# Altium project SIM7600_M_V2.1.PrjPCB
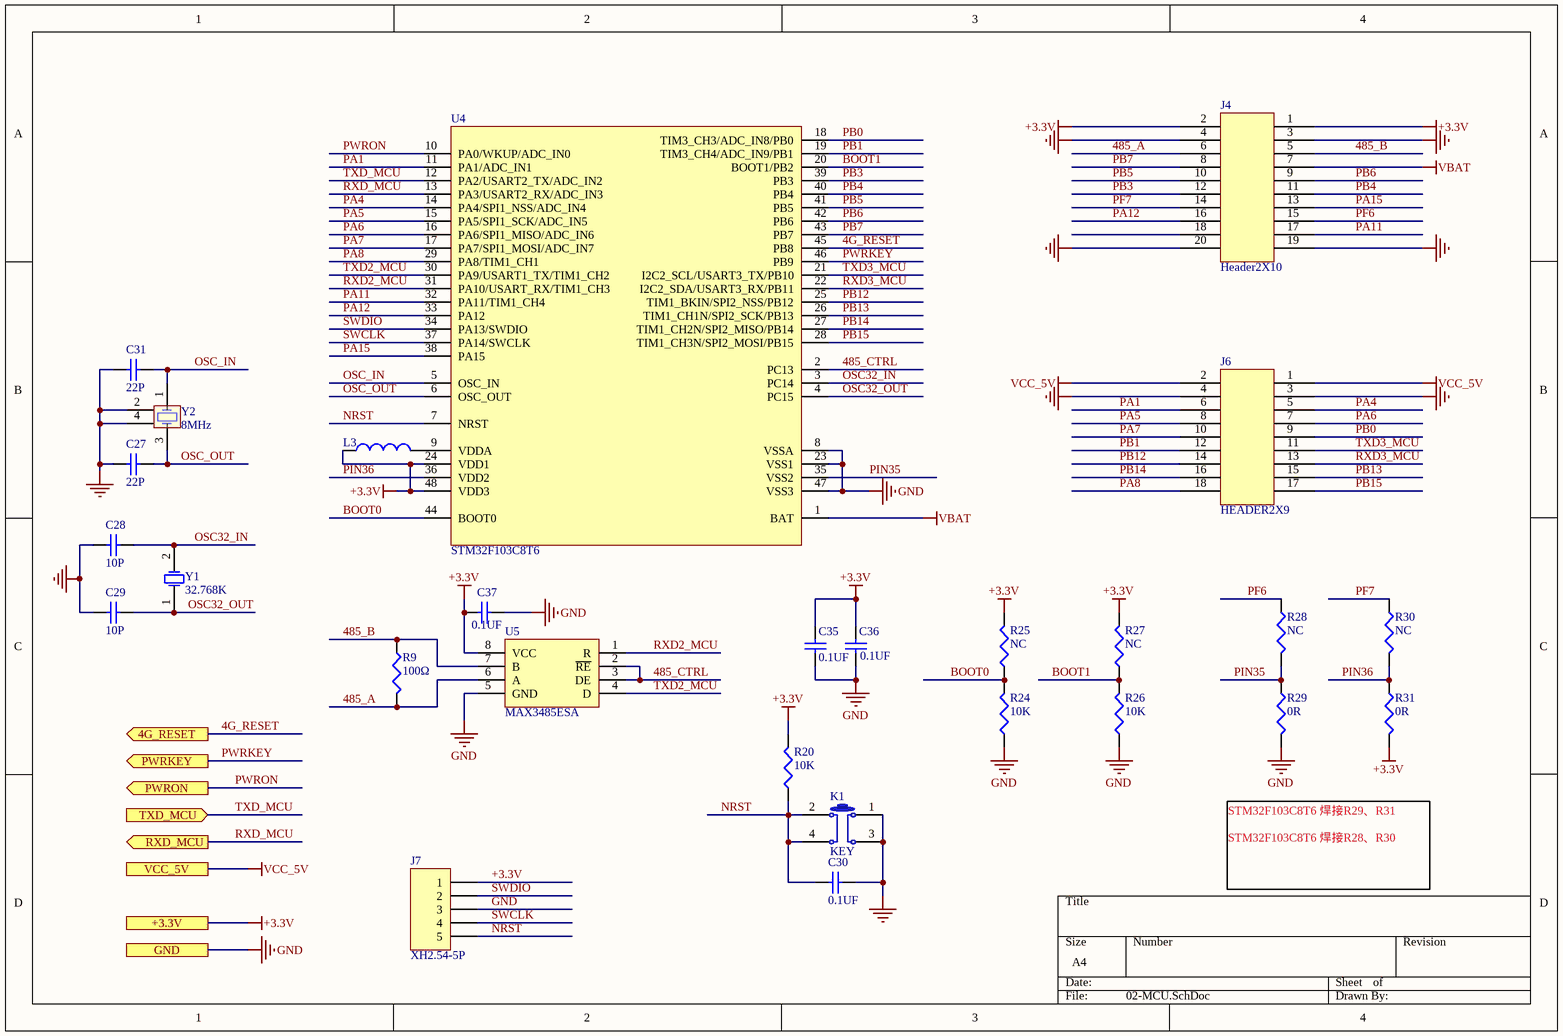
[diagram p0: 02-MCU.SchDoc]
2 sheets, 84 parts. Net scope: flat (ports and power ports of the same name join across sheets).
Board file: SIM7600_M_V2.1.1.PcbDoc
Sheets:
  02-MCU.SchDoc
  03-4G.SchDoc

## Sheet 02-MCU.SchDoc
size A4

### Parts
C27  value 22P  [0603_C]  (hidden comment: Cap)
C28  value 10P  [0603_C]  (hidden comment: Cap)
C29  value 10P  [0603_C]  (hidden comment: Cap)
C30  value 0.1UF  [0603_C]  (hidden comment: Cap)
C31  value 22P  [0603_C]  (hidden comment: Cap)
C35  value 0.1UF  [0603_C]  (hidden comment: Cap)
C36  value 0.1UF  [0603_C]  (hidden comment: Cap)
C37  value 0.1UF  [0603_C]  (hidden comment: Cap)
J4  Header2X10  [DIP20-2.54-2.54]
J6  HEADER2X9  [DIP18-2.54-2.54]
J7  XH2.54-5P  [SIP5]
K1  KEY  [KEY_SMD5465]
L3  Inductor  [0603_R]  (value not drawn)
R9  100Ω  [0603_R]
R20  value 10K  [0603_R]  (hidden comment: Res3)
R24  value 10K  [0603_R]  (hidden comment: Res3)
R25  value NC  [0603_R]  (hidden comment: Res3)
R26  value 10K  [0603_R]  (hidden comment: Res3)
R27  value NC  [0603_R]  (hidden comment: Res3)
R28  value NC  [0603_R]  (hidden comment: Res3)
R29  value 0R  [0603_R]  (hidden comment: Res3)
R30  value NC  [0603_R]  (hidden comment: Res3)
R31  value 0R  [0603_R]  (hidden comment: Res3)
U4  STM32F103C8T6  [LQFP48]
U5  MAX3485ESA  [SO8]
Y1  32.768K  [3215]
Y2  8MHz  [CRY_S3225]

### Ports
4G_RESET, +3.3V, GND, PWRKEY, PWRON, RXD_MCU, TXD_MCU, VCC_5V

### Nets
+3.3V: C35.1 C36.1 C37.1 J4.1 J4.2 J7.1 L3.1 R20.2 R25.2 R27.2 R31.2 U4.24(VDD1) U4.48(VDD3) U5.8(VCC) ; port +3.3V
GND: C27.2 C28.2 C29.2 C30.1 C31.2 C35.2 C36.2 C37.2 J4.3 J4.4 J4.19 J4.20 J6.3 J6.4 J7.3 K1.1 K1.3 R24.1 R26.1 R29.2 U4.8(VSSA) U4.23(VSS1) U4.47(VSS3) U5.5(GND) Y2.2 Y2.4 ; port GND
VBAT: J4.7 U4.1(BAT)
VCC_5V: J6.1 J6.2 ; port VCC_5V
4G_RESET: U4.45(PB8) ; port 4G_RESET
485_A: J4.6 R9.2 U5.6(A)
485_B: J4.5 R9.1 U5.7(B)
485_CTRL: U4.2(PC13) U5.2(~{RE}) U5.3(DE)
BOOT0: R24.2 R25.1 U4.44(BOOT0)
BOOT1: R26.2 R27.1 U4.20(BOOT1/PB2)
NRST: C30.2 J7.5 K1.2 K1.4 R20.1 U4.7(NRST)
OSC32_IN: C28.1 U4.3(PC14) Y1.2(OSC2)
OSC32_OUT: C29.1 U4.4(PC15) Y1.1(OSC1)
OSC_IN: C31.1 U4.5(OSC_IN) Y2.1
OSC_OUT: C27.1 U4.6(OSC_OUT) Y2.3
PA1: J6.6 U4.11(PA1/ADC_IN1)
PA4: J6.5 U4.14(PA4/SPI1_NSS/ADC_IN4)
PA5: J6.8 U4.15(PA5/SPI1_SCK/ADC_IN5)
PA6: J6.7 U4.16(PA6/SPI1_MISO/ADC_IN6)
PA7: J6.10 U4.17(PA7/SPI1_MOSI/ADC_IN7)
PA8: J6.18 U4.29(PA8/TIM1_CH1)
PA11: J4.17 U4.32(PA11/TIM1_CH4)
PA12: J4.16 U4.33(PA12)
PA15: J4.13 U4.38(PA15)
PB0: J6.9 U4.18(TIM3_CH3/ADC_IN8/PB0)
PB1: J6.12 U4.19(TIM3_CH4/ADC_IN9/PB1)
PB3: J4.12 U4.39(PB3)
PB4: J4.11 U4.40(PB4)
PB5: J4.10 U4.41(PB5)
PB6: J4.9 U4.42(PB6)
PB7: J4.8 U4.43(PB7)
PB12: J6.14 U4.25(TIM1_BKIN/SPI2_NSS/PB12)
PB13: J6.15 U4.26(TIM1_CH1N/SPI2_SCK/PB13)
PB14: J6.16 U4.27(TIM1_CH2N/SPI2_MISO/PB14)
PB15: J6.17 U4.28(TIM1_CH3N/SPI2_MOSI/PB15)
PF6: J4.15 R28.1
PF7: J4.14 R30.1
PIN35: R28.2 R29.1 U4.35(VSS2)
PIN36: R30.2 R31.1 U4.36(VDD2)
PWRKEY: U4.46(PB9) ; port PWRKEY
PWRON: U4.10(PA0/WKUP/ADC_IN0) ; port PWRON
RXD2_MCU: U4.31(PA10/USART_RX/TIM1_CH3) U5.1(R)
RXD3_MCU: J6.13 U4.22(I2C2_SDA/USART3_RX/PB11)
RXD_MCU: U4.13(PA3/USART2_RX/ADC_IN3) ; port RXD_MCU
SWCLK: J7.4 U4.37(PA14/SWCLK)
SWDIO: J7.2 U4.34(PA13/SWDIO)
TXD2_MCU: U4.30(PA9/USART1_TX/TIM1_CH2) U5.4(D)
TXD3_MCU: J6.11 U4.21(I2C2_SCL/USART3_TX/PB10)
TXD_MCU: U4.12(PA2/USART2_TX/ADC_IN2) ; port TXD_MCU
NetL3_2: L3.2 U4.9(VDDA)

Not connected (* = marked no-connect by the designer): J4 18

### Notes on the sheet
- STM32F103C8T6 焊接R29、R31
  STM32F103C8T6 焊接R28、R30

### Library data of the parts
C27-C31 C35-C37 = Cap: Capacitor; Published: 8-Jun-2000; LatestRevisionDate: 17-Jul-2002; LatestRevisionNote: Re-released for DXP Platform.; PackageReference: RAD-0.3; Publisher: Altium Limited
J7 = Header 5H: Header, 5-Pin, Right Angle; LatestRevisionDate: 17-Jul-2002; LatestRevisionNote: Re-released for DXP Platform.; Publisher: Altium Limited
L3 = Inductor: Code_IEC: 1005; Value: GZ1608D601TF; Published: 8-Jun-2000; LatestRevisionDate: 17-Jul-2002; LatestRevisionNote: Re-released for DXP Platform.; PackageReference: 0402-A; Publisher: Altium Limited; Code_JEITA: 0402
R9 = RES1
R20 R24-R31 = Res3: Resistor; Published: 8-Jun-2000; LatestRevisionDate: 04-Mar-2005; LatestRevisionNote: PCB Footprint replaced.; PackageReference: J1-0603; Publisher: Altium Limited
U5 = MAX485
Y1 = XTAL: Crystal Oscillator; Published: 8-Jun-2000; LatestRevisionDate: 17-Jul-2002; LatestRevisionNote: Re-released for DXP Platform.; PackageReference: R38; Publisher: Altium Limited
Y2 = CRYSTAL_S4_1: CRYSTAL_S4_PASSIVE

## Sheet 03-4G.SchDoc
size A3
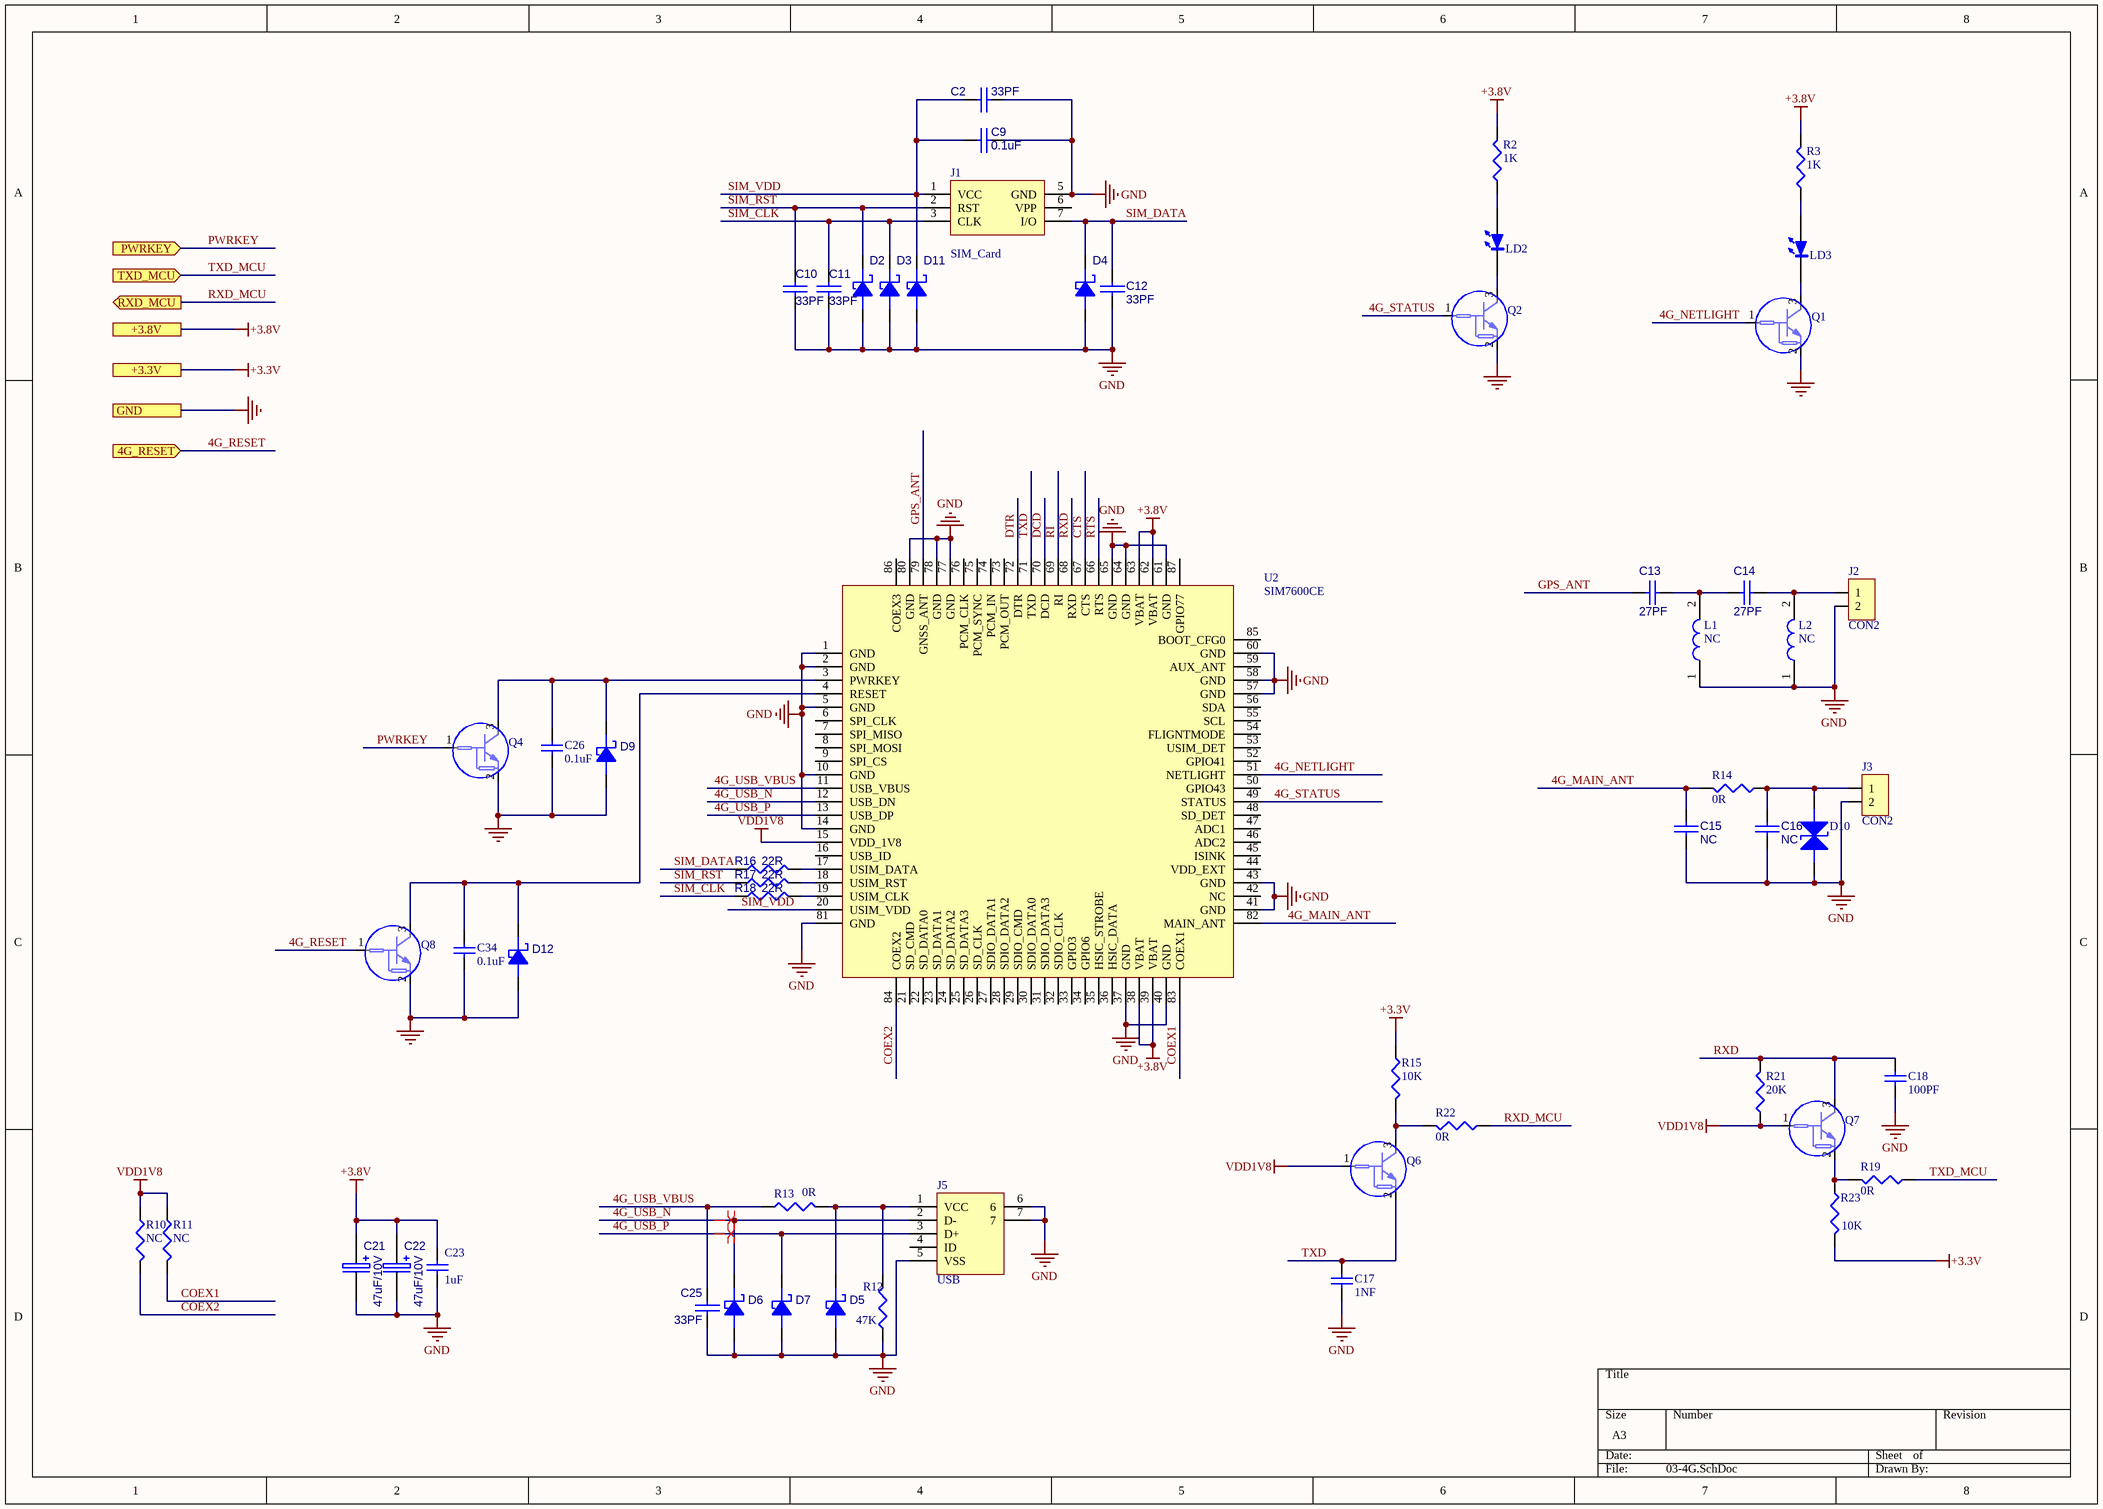
[diagram p1: 03-4G.SchDoc]

### Parts
C2  33PF  [0603_C]
C9  0.1uF  [0603_C]
C10  33PF  [0603_C]
C11  33PF  [0603_C]
C12  33PF  [0603_C]
C13  27PF  [0402]
C14  27PF  [0402]
C15  NC  [0402]
C16  NC  [0402]
C17  1NF  [0603_C]
C18  100PF  [0603_C]
C21  47uF/10V  [C_TAN_B]
C22  47uF/10V  [C_TAN_B]
C23  1uF  [0603_C]
C25  33PF  [0603_C]
C26  0.1uF  [0603_C]
C34  0.1uF  [0603_C]
D2  ESD9M5.0ST5G  [SOD-923]  (value not drawn)
D3  ESD9M5.0ST5G  [SOD-923]  (value not drawn)
D4  ESD9M5.0ST5G  [SOD-923]  (value not drawn)
D5  PESD12VS1UB  [SOD523]  (value not drawn)
D6  ESD9L5.0ST5G  [SOD-923]  (value not drawn)
D7  ESD9L5.0ST5G  [SOD-923]  (value not drawn)
D9  ESD9M5.0ST5G  [SOD-923]  (value not drawn)
D10  LXES15AAA1-153  [0402]  (value not drawn)
D11  ESD9M5.0ST5G  [SOD-923]  (value not drawn)
D12  ESD9M5.0ST5G  [SOD-923]  (value not drawn)
J1  SIM_Card  [MicroSIM-6]
J2  CON2  [RF-Z]
J3  CON2  [RF-Z]
J5  USB
L1  NC  [0402]
L2  NC  [0402]
LD2  WHITE  [LED_0603]  (value not drawn)
LD3  WHITE  [LED_0603]  (value not drawn)
Q1  DTC143ZEBTL  [SC-85]  (value not drawn)
Q2  DTC143ZEBTL  [SC-85]  (value not drawn)
Q4  DTC143ZEBTL  [SC-85]  (value not drawn)
Q6  DTC143ZEBTL  [SC-85]  (value not drawn)
Q7  DTC143ZEBTL  [SC-85]  (value not drawn)
Q8  DTC143ZEBTL  [SC-85]  (value not drawn)
R2  1K  [0603_R]
R3  1K  [0603_R]
R10  NC  [0603_R]
R11  NC  [0603_R]
R12  47K  [0603_R]
R13  0R  [0603_R]
R14  0R  [0402]
R15  10K  [0603_R]
R16  22R  [0603_R]
R17  22R  [0603_R]
R18  22R  [0603_R]
R19  0R  [0603_R]
R21  20K  [0603_R]
R22  0R  [0603_R]
R23  10K  [0603_R]
U2  SIM7600CE  [SIM7600]

### Ports
4G_RESET, +3.3V, +3.8V, GND, PWRKEY, RXD_MCU, TXD_MCU

### Nets
+3.3V: R15.1 R23.2 ; port +3.3V
+3.8V: C21.1(+) C22.1(+) C23.2 R2.1 R3.1 U2.38(VBAT) U2.39(VBAT) U2.62(VBAT) U2.63(VBAT) ; port +3.8V
GND: C2.2 C9.2 C10.1 C11.1 C12.1 C15.1 C16.1 C17.2 C18.1 C21.2(-) C22.2(-) C23.1 C25.2 C26.1 C34.1 D2.1(ANODE) D3.1(ANODE) D4.1(ANODE) D5.1(ANODE) D6.1(ANODE) D7.1(ANODE) D9.1(ANODE) D10.2 D11.1(ANODE) D12.1(ANODE) J1.5(GND) J2.2 J3.2 J5.5(VSS) J5.6 J5.7 L1.1 L2.1 Q1.2(E) Q2.2(E) Q4.2(E) Q8.2(E) R12.2 U2.1(GND) U2.2(GND) U2.5(GND) U2.10(GND) U2.14(GND) U2.37(GND) U2.40(GND) U2.41(GND) U2.43(GND) U2.57(GND) U2.58(GND) U2.60(GND) U2.61(GND) U2.64(GND) U2.65(GND) U2.77(GND) U2.78(GND) U2.80(GND) U2.81(GND) ; port GND
VDD1V8: Q6.1(B) Q7.1(B) R10.1 R11.1 R21.1 U2.15(VDD_1V8)
4G_MAIN_ANT: C15.2 R14.2 U2.82(MAIN_ANT)
4G_NETLIGHT: Q1.1(B) U2.51(NETLIGHT)
4G_RESET: Q8.1(B) ; port 4G_RESET
4G_STATUS: Q2.1(B) U2.49(STATUS)
4G_USB_N: D6.2(CATHODE) J5.2(D-) U2.12(USB_DN)
4G_USB_P: D7.2(CATHODE) J5.3(D+) U2.13(USB_DP)
4G_USB_VBUS: C25.1 R13.1 U2.11(USB_VBUS)
COEX1: R11.2 U2.83(COEX1)
COEX2: R10.2 U2.84(COEX2)
CTS: U2.67(CTS)
DCD: U2.70(DCD)
DTR: U2.72(DTR)
GPS_ANT: C13.1 U2.79(GNSS_ANT)
PWRKEY: Q4.1(B) ; port PWRKEY
RI: U2.69(RI)
RTS: U2.66(RTS)
RXD: C18.2 Q7.3(C) R21.2 U2.68(RXD)
RXD_MCU: R22.1 ; port RXD_MCU
SIM_CLK: C11.2 D3.2(CATHODE) J1.3(CLK) R18.1
SIM_DATA: C12.2 D4.2(CATHODE) J1.7(I/O) R16.1
SIM_RST: C10.2 D2.2(CATHODE) J1.2(RST) R17.1
SIM_VDD: C2.1 C9.1 D11.2(CATHODE) J1.1(VCC) U2.20(USIM_VDD)
TXD: C17.1 Q6.2(E) U2.71(TXD)
TXD_MCU: R19.1 ; port TXD_MCU
NetC13_2: C13.2 C14.1 L1.2
NetC14_2: C14.2 J2.1 L2.2
NetC16_2: C16.2 D10.1 J3.1 R14.1
NetC26_2: C26.2 D9.2(CATHODE) Q4.3(C) U2.3(PWRKEY)
NetC34_2: C34.2 D12.2(CATHODE) Q8.3(C) U2.4(RESET)
NetD5_2: D5.2(CATHODE) J5.1(VCC) R12.1 R13.2
NetLD2_A: LD2.A R2.2
NetLD2_K: LD2.K Q2.3(C)
NetLD3_A: LD3.A R3.2
NetLD3_K: LD3.K Q1.3(C)
NetQ6_3: Q6.3(C) R15.2 R22.2
NetQ7_2: Q7.2(E) R19.2 R23.1
NetR16_2: R16.2 U2.17(USIM_DATA)
NetR17_2: R17.2 U2.18(USIM_RST)
NetR18_2: R18.2 U2.19(USIM_CLK)

Not connected (* = marked no-connect by the designer): J1 6(VPP); J5 4(ID); U2 6(SPI_CLK) 7(SPI_MISO) 8(SPI_MOSI) 9(SPI_CS) 16(USB_ID) 21(SD_CMD) 22(SD_DATA0) 23(SD_DATA1) 24(SD_DATA2) 25(SD_DATA3) 26(SD_CLK) 27(SDIO_DATA1) 28(SDIO_DATA2) 29(SDIO_CMD) 30(SDIO_DATA0) 31(SDIO_DATA3) 32(SDIO_CLK) 33(GPIO3) 34(GPIO6) 35(HSIC_STROBE) 36(HSIC_DATA) 42(NC) 44(VDD_EXT) 45(ISINK) 46(ADC2) 47(ADC1) 48(SD_DET) 50(GPIO43) 52(GPIO41) 53(USIM_DET) 54(FLIGNTMODE) 55(SCL) 56(SDA) 59(AUX_ANT) 73(PCM_OUT) 74(PCM_IN) 75(PCM_SYNC) 76(PCM_CLK) 85(BOOT_CFG0) 86(COEX3) 87(GPIO77)

### Layout directives
differential pair: 4G_USB_N, 4G_USB_P

### Library data of the parts
C2 C9-C16 C25 = CAP
C17 C18 C23 C26 C34 = Cap Semi: Capacitor; Published: 8-Jun-2000; LatestRevisionDate: 29-May-2009; LatestRevisionNote: IPC-7351 Footprint Added.; PackageReference: C1206; Publisher: Altium Limited; PackageDescription: Chip Capacitor
C21 C22 = ECAP: E-CAP
D2-D7 D9 D11 D12 = DIODE SCHOTTKY
D10 = DIODE TVS BI-DIR
J5 = USB-M
L1 L2 = L
LD2 LD3 = LED
Q1 Q2 Q4 Q6-Q8 = DTC143ZETL
R2 R3 R10-R15 R19 R21-R23 = RES1
R16-R18 = R0.25W: RESISTOR
U2 = SIM7600

## Nets that join several sheets
+3.3V: 02-MCU (14 pins), 03-4G (R15.1 R23.2)
GND: 02-MCU (26 pins), 03-4G (57 pins)
4G_RESET: 02-MCU (U4.45), 03-4G (Q8.1)
PWRKEY: 02-MCU (U4.46), 03-4G (Q4.1)
RXD_MCU: 02-MCU (U4.13), 03-4G (R22.1)
TXD_MCU: 02-MCU (U4.12), 03-4G (R19.1)